# EAGLE design graphic_stereo (EAGLE 7.4.0)
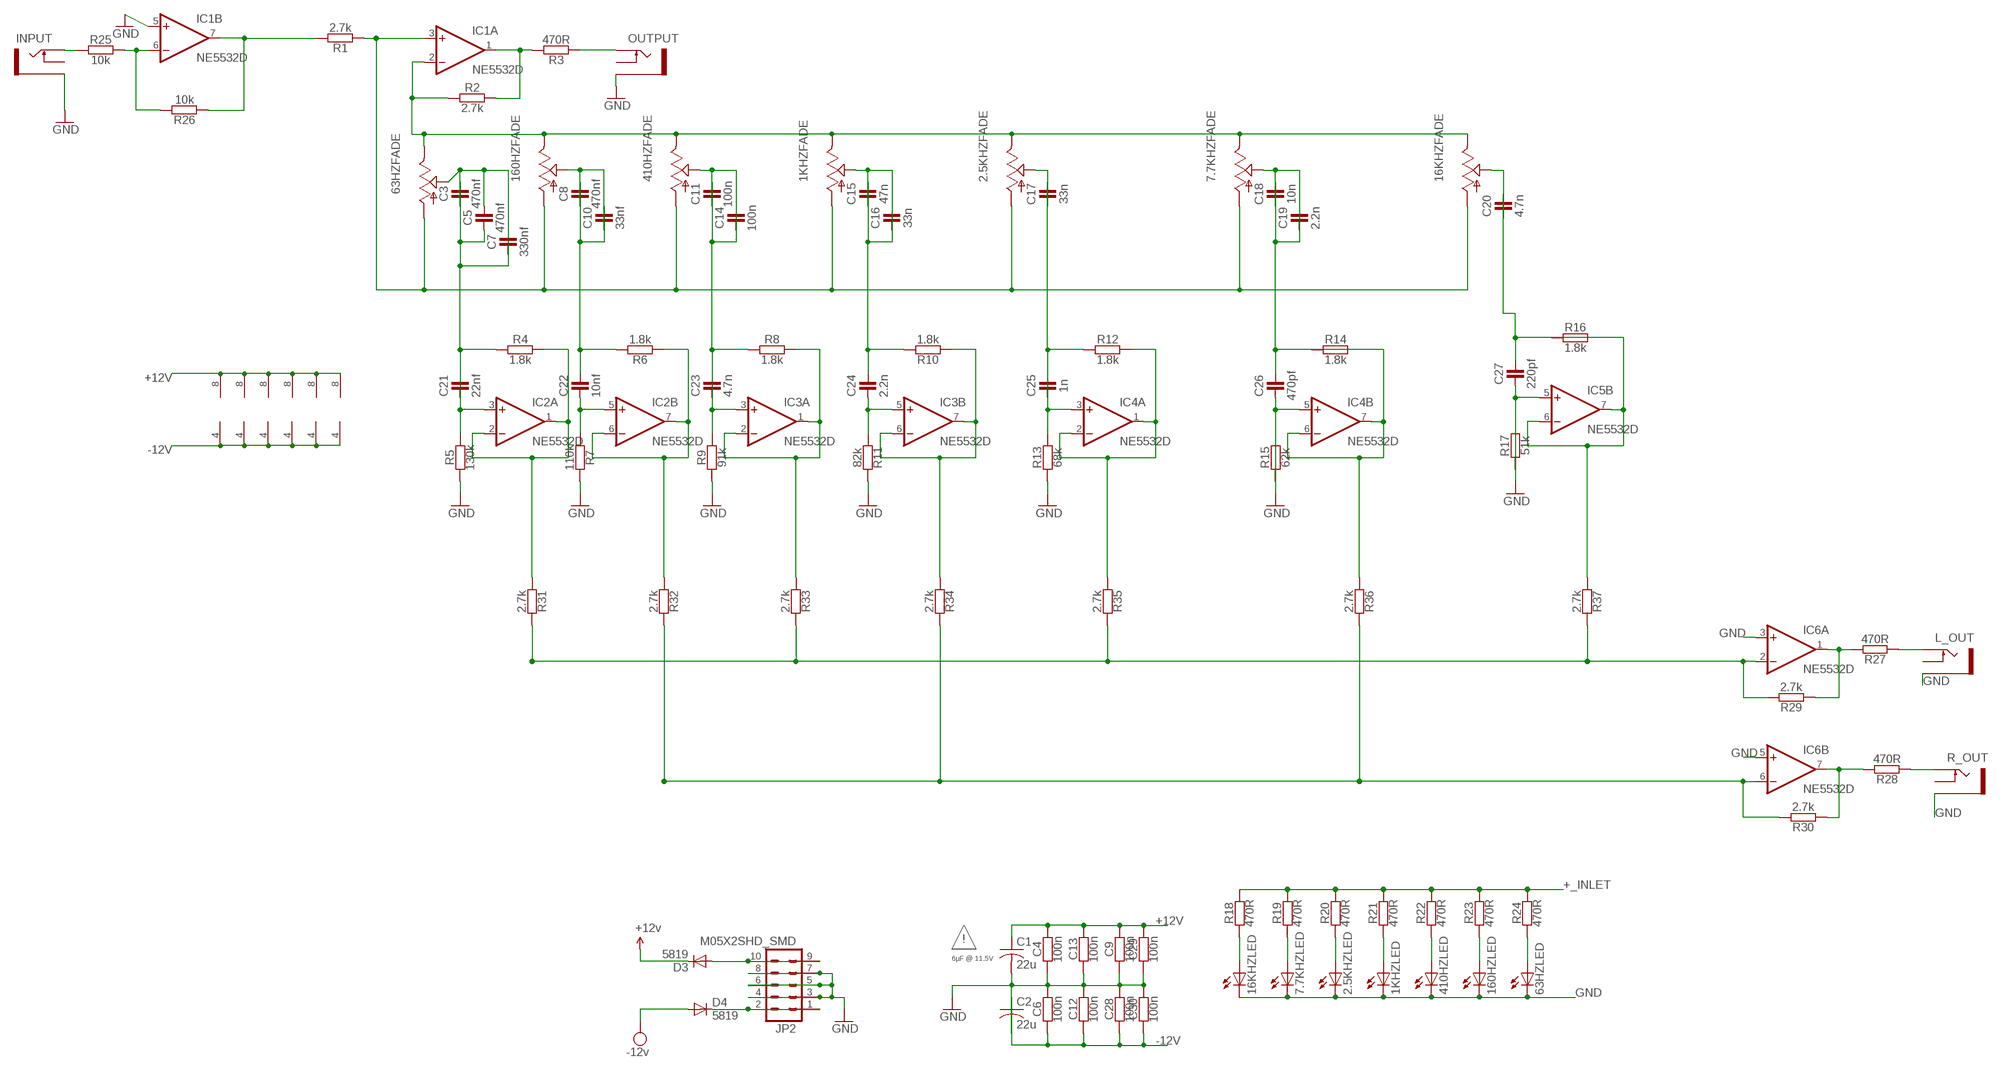
[diagram p0: schematic, sheet 1]

## Parts
1KHZ  ALPHA_20MM_ILLUM_FADER  [ALPHA_ILL_FADER_20MM]
2.5KHZ  ALPHA_20MM_ILLUM_FADER  [ALPHA_ILL_FADER_20MM]
7.7KHZ  ALPHA_20MM_ILLUM_FADER  [ALPHA_ILL_FADER_20MM]
16KHZ  ALPHA_20MM_ILLUM_FADER  [ALPHA_ILL_FADER_20MM]
63HZ  ALPHA_20MM_ILLUM_FADER  [ALPHA_ILL_FADER_20MM]
160HZ  ALPHA_20MM_ILLUM_FADER  [ALPHA_ILL_FADER_20MM]
410HZ  ALPHA_20MM_ILLUM_FADER  [ALPHA_ILL_FADER_20MM]
C1  22u  C-USC1206  [C1206]
C2  22u  C-USC1206  [C1206]
C3  470nf  CAPACITOR-0805  [C0805]
C4  100n  RESISTOR-0805  [C0805]
C5  470nf  CAPACITOR-0805  [C0805]
C6  100n  RESISTOR-0805  [C0805]
C7  330nf  CAPACITOR-0805  [C0805]
C8  470nf  CAPACITOR-0805  [C0805]
C9  100n  RESISTOR-0805  [C0805]
C10  33nf  CAPACITOR-0805  [C0805]
C11  100n  CAPACITOR-0805  [C0805]
C12  100n  RESISTOR-0805  [C0805]
C13  100n  RESISTOR-0805  [C0805]
C14  100n  CAPACITOR-0805  [C0805]
C15  47n  CAPACITOR-0805  [C0805]
C16  33n  CAPACITOR-0805  [C0805]
C17  33n  CAPACITOR-0805  [C0805]
C18  10n  CAPACITOR-0805  [C0805]
C19  2.2n  CAPACITOR-0805  [C0805]
C20  4.7n  CAPACITOR-0805  [C0805]
C21  22nf  CAPACITOR-0805  [C0805]
C22  10nf  CAPACITOR-0805  [C0805]
C23  4.7n  CAPACITOR-0805  [C0805]
C24  2.2n  CAPACITOR-0805  [C0805]
C25  1n  CAPACITOR-0805  [C0805]
C26  470pf  CAPACITOR-0805  [C0805]
C27  220pf  CAPACITOR-0805  [C0805]
C28  100n  RESISTOR-0805  [C0805]
C29  100n  RESISTOR-0805  [C0805]
C30  100n  RESISTOR-0805  [C0805]
D3  5819  DIODE-SOD123  [SOD123]
D4  5819  DIODE-SOD123  [SOD123]
IC1  NE5532D  [SO08]
IC2  NE5532D  [SO08]
IC3  NE5532D  [SO08]
IC4  NE5532D  [SO08]
IC5  NE5532D  [SO08]
IC6  NE5532D  [SO08]
INPUT  THONKICONNNEW  [WQP-PJ301M-12_JACK]
JP2  M05X2SHD_SMD  [2X5-SHROUDED_SMD]
L_OUT  THONKICONNNEW  [WQP-PJ301M-12_JACK]
OUTPUT  THONKICONNNEW  [WQP-PJ301M-12_JACK]
R1  2.7k  RESISTOR-0805  [C0805]
R2  2.7k  RESISTOR-0805  [C0805]
R3  470R  RESISTOR-0805  [C0805]
R4  1.8k  RESISTOR-0805  [C0805]
R5  130k  RESISTOR-0805  [C0805]
R6  1.8k  RESISTOR-0805  [C0805]
R7  110k  RESISTOR-0805  [C0805]
R8  1.8k  RESISTOR-0805  [C0805]
R9  91k  RESISTOR-0805  [C0805]
R10  1.8k  RESISTOR-0805  [C0805]
R11  82k  RESISTOR-0805  [C0805]
R12  1.8k  RESISTOR-0805  [C0805]
R13  68k  RESISTOR-0805  [C0805]
R14  1.8k  RESISTOR-0805  [C0805]
R15  62k  RESISTOR-0805  [C0805]
R16  1.8k  RESISTOR-0805  [C0805]
R17  51k  RESISTOR-0805  [C0805]
R18  470R  RESISTOR-0805  [C0805]
R19  470R  RESISTOR-0805  [C0805]
R20  470R  RESISTOR-0805  [C0805]
R21  470R  RESISTOR-0805  [C0805]
R22  470R  RESISTOR-0805  [C0805]
R23  470R  RESISTOR-0805  [C0805]
R24  470R  RESISTOR-0805  [C0805]
R25  10k  RESISTOR-0805  [C0805]
R26  10k  RESISTOR-0805  [C0805]
R27  470R  RESISTOR-0805  [C0805]
R28  470R  RESISTOR-0805  [C0805]
R29  2.7k  RESISTOR-0805  [C0805]
R30  2.7k  RESISTOR-0805  [C0805]
R31  2.7k  RESISTOR-0805  [C0805]
R32  2.7k  RESISTOR-0805  [C0805]
R33  2.7k  RESISTOR-0805  [C0805]
R34  2.7k  RESISTOR-0805  [C0805]
R35  2.7k  RESISTOR-0805  [C0805]
R36  2.7k  RESISTOR-0805  [C0805]
R37  2.7k  RESISTOR-0805  [C0805]
R_OUT  THONKICONNNEW  [WQP-PJ301M-12_JACK]

## Nets
+12V: C1.1 C4.2 C9.2 C13.2 C29.2 D3.C IC1.8(P:V+) IC2.8(P:V+) IC3.8(P:V+) IC4.8(P:V+) IC5.8(P:V+) IC6.8(P:V+) ; supply symbol labelled +12v
+_INLET: D3.A JP2.9 JP2.10 R18.2 R19.2 R20.2 R21.2 R22.2 R23.2 R24.2
-12V: C2.1 C6.1 C12.1 C28.1 C30.1 D4.A IC1.4(P:V-) IC2.4(P:V-) IC3.4(P:V-) IC4.4(P:V-) IC5.4(P:V-) IC6.4(P:V-) ; supply symbol labelled -12v
-_INLET: D4.C JP2.1 JP2.2
GND: 1KHZ.E(LED:C) 2.5KHZ.E(LED:C) 7.7KHZ.E(LED:C) 16KHZ.E(LED:C) 63HZ.E(LED:C) 160HZ.E(LED:C) 410HZ.E(LED:C) C1.2 C2.2 C4.1 C6.2 C9.1 C12.2 C13.1 C28.2 C29.1 C30.2 IC1.5(B:+IN) IC6.3(A:+IN) IC6.5(B:+IN) INPUT.P$3_SLEEVE(SLEEVE) JP2.3 JP2.4 JP2.5 JP2.6 JP2.7 JP2.8 L_OUT.P$3_SLEEVE(SLEEVE) OUTPUT.P$3_SLEEVE(SLEEVE) R5.1 R7.2 R9.1 R11.2 R13.1 R15.2 R17.2 R_OUT.P$3_SLEEVE(SLEEVE)
N$1: IC6.1(A:OUT) R27.2 R29.1
N$2: INPUT.P$1_TIP(TIP) R25.1
N$3: 1KHZ.3(FADE:A) 2.5KHZ.3(FADE:A) 7.7KHZ.3(FADE:A) 16KHZ.3(FADE:A) 63HZ.3(FADE:A) 160HZ.3(FADE:A) 410HZ.3(FADE:A) IC1.3(A:+IN) R1.1
N$4: 410HZ.2(FADE:S) C11.1 C14.1
N$5: IC1.1(A:OUT) R2.2 R3.2
N$6: OUTPUT.P$1_TIP(TIP) R3.1
N$7: 1KHZ.1(FADE:E) 2.5KHZ.1(FADE:E) 7.7KHZ.1(FADE:E) 16KHZ.1(FADE:E) 63HZ.1(FADE:E) 160HZ.1(FADE:E) 410HZ.1(FADE:E) IC1.2(A:-IN) R2.1
N$8: 63HZ.2(FADE:S) C3.1 C5.2 C7.1
N$9: IC1.6(B:-IN) R25.2 R26.2
N$10: 16KHZ.B(LED:A) R18.1
N$11: 2.5KHZ.2(FADE:S) C17.1
N$12: 1KHZ.2(FADE:S) C15.1 C16.1
N$13: 7.7KHZ.B(LED:A) R19.1
N$14: 160HZ.2(FADE:S) C8.1 C10.1
N$15: 2.5KHZ.B(LED:A) R20.1
N$16: C23.2 IC3.3(A:+IN) R9.2
N$17: C3.2 C5.1 C7.2 C21.1 R4.1
N$18: C8.2 C10.2 C22.2 R6.2
N$19: 7.7KHZ.2(FADE:S) C18.1 C19.1
N$20: 1KHZ.B(LED:A) R21.1
N$21: IC3.1(A:OUT) IC3.2(A:-IN) R8.2 R33.1
N$22: L_OUT.P$1_TIP(TIP) R27.1
N$23: 16KHZ.2(FADE:S) C20.1
N$24: C24.1 IC3.5(B:+IN) R11.1
N$25: C21.2 IC2.3(A:+IN) R5.2
N$26: IC2.1(A:OUT) IC2.2(A:-IN) R4.2 R31.1
N$27: IC3.6(B:-IN) IC3.7(B:OUT) R10.1 R34.1
N$28: C22.1 IC2.5(B:+IN) R7.1
N$29: IC2.6(B:-IN) IC2.7(B:OUT) R6.1 R32.1
N$30: C11.2 C14.2 C23.1 R8.1
N$31: C15.2 C16.2 C24.2 R10.2
N$32: C25.2 IC4.3(A:+IN) R13.2
N$33: IC4.1(A:OUT) IC4.2(A:-IN) R12.2 R35.1
N$34: C26.1 IC4.5(B:+IN) R15.1
N$35: IC4.6(B:-IN) IC4.7(B:OUT) R14.1 R36.1
N$36: C17.2 C25.1 R12.1
N$37: C18.2 C19.2 C26.2 R14.2
N$38: C27.1 IC5.5(B:+IN) R17.1
N$39: IC5.6(B:-IN) IC5.7(B:OUT) R16.1 R37.1
N$40: C20.2 C27.2 R16.2
N$41: 410HZ.B(LED:A) R22.1
N$42: 160HZ.B(LED:A) R23.1
N$43: 63HZ.B(LED:A) R24.1
N$44: R28.1 R_OUT.P$1_TIP(TIP)
N$45: IC1.7(B:OUT) R1.2 R26.1
N$46: IC6.7(B:OUT) R28.2 R30.1
N$47: IC6.6(B:-IN) R30.2 R32.2 R34.2 R36.2
N$49: IC6.2(A:-IN) R29.2 R31.2 R33.2 R35.2 R37.2
Unconnected: IC5.1(A:OUT) IC5.2(A:-IN) IC5.3(A:+IN) INPUT.P$2_SWITCH(SWITCH) L_OUT.P$2_SWITCH(SWITCH) OUTPUT.P$2_SWITCH(SWITCH) R_OUT.P$2_SWITCH(SWITCH)

## Notes on the sheet
- !
- 6µF @ 11.5V

## Library data of the parts
1KHZ 2.5KHZ 7.7KHZ 16KHZ 63HZ 160HZ 410HZ = TomW:ALPHA_20MM_ILLUM_FADER: 30mm Alpha Illuminated Fader
C1 C2 = rcl:C-US: CAPACITOR, American symbol
C3 C5 C7 C8 C10 C11 C14-C27 = we-rcl:CAPACITOR: Capacitors ...2.2uF @ 6.3V -> 0402 ...4.7uF @ 6.3V -> 0603 ...10uF @ 16V -> 0805 ...22uF @ 25V -> 1206
C4 C6 C9 C12 C13 C28-C30 R1-R37 = we-rcl:RESISTOR: Resistors all kinds in 0402 and 0603
D3 D4 = diode:DIODE-: DIODE
IC1-IC6 = linear:NE5532: AUDIO AMPLIFIER
INPUT L_OUT OUTPUT R_OUT = MusicThingModular:THONKICONN: 3.5mm socket for Eurorack modular synths
JP2 = SparkFun-Connectors:M05X2: Header 5x2 Standard 10-pin dual row 0.1" header. Commonly used with AVR-ISP. Use with Spark Fun Electronics SKU: PRT-00778

## Net classes
0 default: width 0.203 mm
1 power: width 0.406 mm

## Board
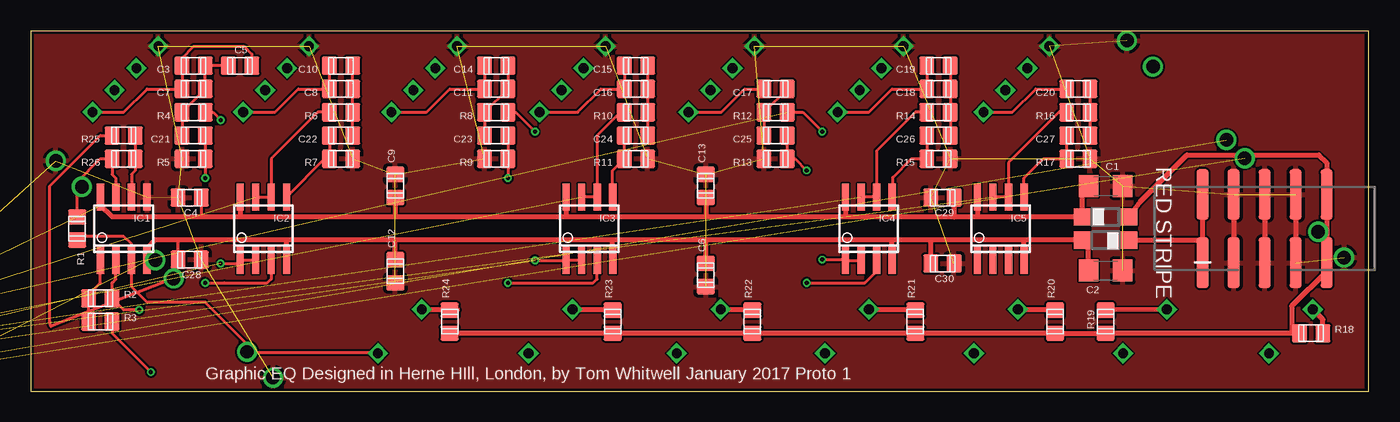
[diagram p1: board, top side]
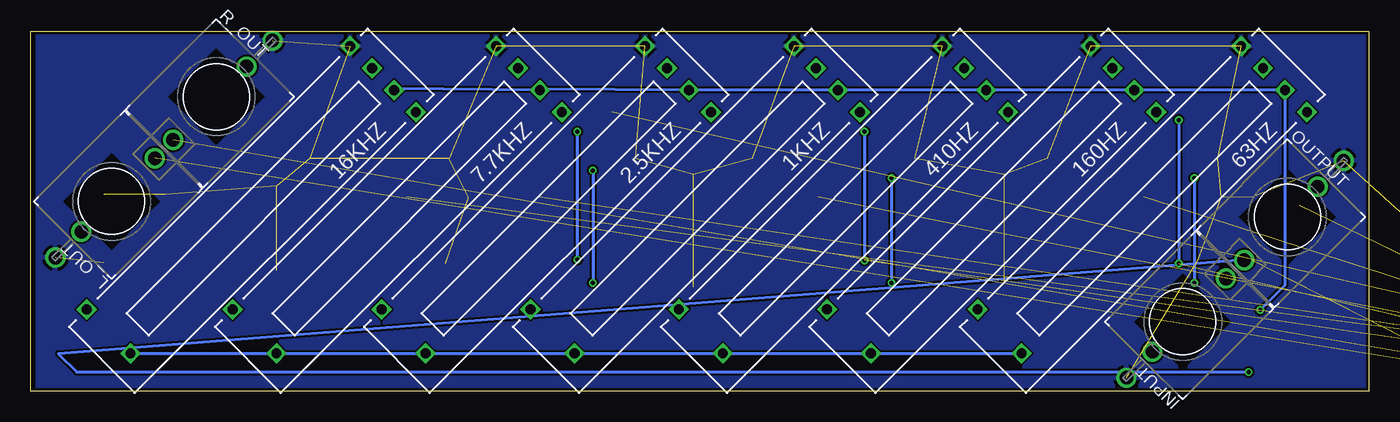
[diagram p2: board, bottom side, seen from below]

Size 109.5 x 29.5 mm. Coordinates in mm from the lower left corner, seen from the top.
Outline: 0,0 109.5,0 109.5,29.5 0,29.5 0,0
Copper layers (1*2*15*16): Top 0.035mm / dielectric 0.2mm / Route2 0.0175mm / dielectric 1.1mm / Route15 0.0175mm / dielectric 0.2mm / Bottom 0.035mm
Design rules "SeeedStudio_DRU_no_angle_20130527": minimum track width 6mil, minimum drill 12mil, track to track 6mil, track to pad 6mil, pad to pad 6mil, via to via 6mil, smd to smd 0mil, copper to edge 10mil, drill to drill 10mil, minimum pad ring 6mil, minimum via ring 6mil, stop-mask expansion 2mil, vias tented up to drill 25mil, thermal gap 10mil

### Footprints (pad centres in the part's own frame; a part is rotated, then mirrored left to right if it is on the bottom)
ALPHA_ILL_FADER_20MM = drill 0.8 square: 1 -15.24,1.27; 2 -15.24,3.81; 3 15.24,1.27; B 15.24,-3.81; E -15.24,-3.81; L -15.24,-1.27
C1206 = smd 1.6 x 1.8: 1 -1.4,0; 2 1.4,0
C0805 = smd 1.5 x 1.25: 1 0,0.95; 2 0,-0.95
SOD123 = smd 1.4 x 1.4: A 1.9,0; C -1.9,0
SO08 = smd 0.6 x 2.2: 1 -1.905,-2.6; 2 -0.635,-2.6; 3 0.635,-2.6; 4 1.905,-2.6; 5 1.905,2.6; 6 0.635,2.6; 7 -0.635,2.6; 8 -1.905,2.6
WQP-PJ301M-12_JACK = drill 1.1: P$1_TIP 0,5; P$2_SWITCH 0,-3.5; P$3_SLEEVE 0,-6.5
2X5-SHROUDED_SMD = smd 4.15 x 1: 1 -2.794,5.08; 2 2.794,5.08; 3 -2.794,2.54; 4 2.794,2.54; 5 -2.794,0; 6 2.794,0; 7 -2.794,-2.54; 8 2.794,-2.54; 9 -2.794,-5.08; 10 2.794,-5.08

### Placement (x,y rotation side)
1KHZ  55.12,14.8 225 bottom
2.5KHZ  67.31,14.8 225 bottom
7.7KHZ  79.5,14.8 225 bottom
16KHZ  91.44,14.8 225 bottom
63HZ  18.54,14.8 225 bottom
160HZ  30.86,14.8 225 bottom
410HZ  42.99,14.8 225 bottom
C1  87.95,16.83 0 top
C2  87.95,9.91 0 top
C3  13.34,26.67 90 top
C4  13.02,15.88 90 top
C5  17.14,26.67 90 top
C6  55.24,9.53 0 top
C7  13.34,24.77 90 top
C8  25.4,24.77 90 top
C9  29.84,16.83 0 top
C10  25.4,26.67 90 top
C11  38.1,24.77 90 top
C12  29.84,9.84 0 top
C13  55.24,16.83 0 top
C14  38.1,26.67 90 top
C15  49.53,26.67 90 top
C16  49.53,24.77 90 top
C17  60.96,24.77 90 top
C18  74.3,24.77 90 top
C19  74.3,26.67 90 top
C20  85.72,24.77 90 top
C21  13.34,20.95 90 top
C22  25.4,20.95 90 top
C23  38.1,20.95 90 top
C24  49.53,20.95 90 top
C25  60.96,20.95 90 top
C26  74.3,20.95 90 top
C27  85.72,20.95 90 top
C28  13.02,10.79 90 top
C29  74.61,15.88 90 top
C30  74.61,10.48 90 top
D3  87.95,14.29 0 top
D4  87.95,12.38 180 top
IC1  7.62,13.34 0 top
IC2  19.05,13.34 0 top
IC3  45.72,13.34 0 top
IC4  68.58,13.34 0 top
IC5  79.38,13.34 0 top
IC6  -17.14,0.64 0 top  (outside the outline)
INPUT  15.24,5.71 315 bottom
JP2  100.97,13.34 90 top
L_OUT  102.87,15.56 315 bottom
OUTPUT  6.67,14.29 135 bottom
R1  3.81,13.34 180 top
R2  5.71,7.62 270 top
R3  5.71,5.71 270 top
R4  13.34,22.86 90 top
R5  13.34,19.05 90 top
R6  25.4,22.86 90 top
R7  25.4,19.05 90 top
R8  38.1,22.86 90 top
R9  38.1,19.05 90 top
R10  49.53,22.86 90 top
R11  49.53,19.05 90 top
R12  60.96,22.86 90 top
R13  60.96,19.05 90 top
R14  74.3,22.86 90 top
R15  74.3,19.05 90 top
R16  85.72,22.86 90 top
R17  85.72,19.05 90 top
R18  104.78,4.76 270 top
R19  87.95,5.71 0 top
R20  83.82,5.71 0 top
R21  72.39,5.71 0 top
R22  59.05,5.71 0 top
R23  47.62,5.71 0 top
R24  34.29,5.71 0 top
R25  7.62,20.95 90 top
R26  7.62,19.05 90 top
R27  -20.95,-1.27 0 top  (outside the outline)
R28  -23.18,-1.27 0 top  (outside the outline)
R29  -25.4,-1.27 0 top  (outside the outline)
R30  -27.62,-1.27 0 top  (outside the outline)
R31  -29.84,-1.27 0 top  (outside the outline)
R32  -32.07,-1.27 0 top  (outside the outline)
R33  -34.29,-1.27 0 top  (outside the outline)
R34  -36.51,-1.27 0 top  (outside the outline)
R35  -38.73,-1.27 0 top  (outside the outline)
R36  -40.96,-1.27 0 top  (outside the outline)
R37  -43.18,-1.27 0 top  (outside the outline)
R_OUT  94.3,24.13 135 bottom

### Tracks (layer width: path | path; a pad name or v marks a point on that pad's centre or on a via)
+12V  (1 unrouted)
  Top 0.254: 86.05,17.01 C1.1 | C4.2 13.97,14.29
  Top 0.406: 77.47,14.29 D3.C 86.05,17.01 | 77.47,14.29 75.56,14.29 | 75.56,14.29 66.67,14.29 | 66.67,14.29 55.24,14.29 | 55.24,14.29 43.81,14.29 | 43.81,14.29 29.84,14.29 | 29.84,14.29 17.14,14.29 | 17.14,14.29 13.97,14.29 6.67,14.29 5.71,15.24 IC1.8 | IC5.8 77.47,14.29 | IC4.8 66.67,14.29 | IC3.8 43.81,14.29 | IC2.8 17.14,14.29 | C13.2 55.24,14.29 | C9.2 29.84,14.29 | C29.2 75.56,14.29
+_INLET
  Top 0.406: D3.A 90.8,15.55 94.61,19.37 105.41,19.37 106.05,18.73 JP2.10 JP2.9 106.05,9.84 103.19,6.99 103.19,4.76 | R18.2 103.19,4.76 | 103.19,4.76 R19.2 R20.2 R21.2 R22.2 | R22.2 58.42,4.76 R22.2 | R22.2 R23.2 R24.2
-12V  (1 unrouted)
  Top 0.254: C28.1 12.07,12.38 12.06,12.38 | 86.55,11.93 D4.A
  Top 0.406: D4.A 81.28,12.38 | 81.28,12.38 73.66,12.38 | 73.66,12.38 70.48,12.38 | 70.48,12.38 55.24,12.38 | 55.24,12.38 47.62,12.38 | 47.62,12.38 29.84,12.38 | 29.84,12.38 20.95,12.38 | 20.95,12.38 12.06,12.38 10.16,12.38 9.53,11.75 IC1.4 | IC2.4 20.95,12.38 | IC3.4 47.62,12.38 | IC4.4 70.48,12.38 | IC5.4 81.28,12.38 | C6.1 55.24,12.38 | C12.1 29.84,12.38 | C30.1 73.66,12.38 | C2.1 86.55,11.93
-_INLET
  Top 0.406: JP2.2 95.89,12.38 | 95.89,12.38 JP2.1 | D4.C 95.89,12.38
GND  (33 unrouted)
  Top 0.406: JP2.8 JP2.7 | JP2.6 JP2.5 | JP2.4 JP2.3
  pour Top: 0,29.53 108.9,29.53 108.9,0 0,0
  pour Bottom: 0,29.53 108.9,29.53 108.9,0 0,0 0,29.21
N$1  (2 unrouted)
N$2
  Top 0.254: INPUT.P$1_TIP 1.67,5.32 1.59,5.71 1.59,16.83 5.71,20.95 R25.1
N$3
  Top 0.254: 63HZ.3 28.31,3.12 28.26,3.17 18.41,3.17 14.29,7.3 9.53,7.3 8.26,8.57 IC1.3 8.26,12.06 7.62,12.7 4.12,12.7 R1.1
  Bottom 0.254: 16KHZ.3 7.7KHZ.3 2.5KHZ.3 | 2.5KHZ.3 76.57,3.12 76.52,3.17 77.13,3.17 2.5KHZ.3 | 2.5KHZ.3 1KHZ.3 410HZ.3 160HZ.3 63HZ.3
N$4
  Top 0.254: 410HZ.2 32.4,22.88 34.29,24.77 C11.1 C14.1
N$5
  Top 0.254: R3.2 R2.2 4.76,7.94 5.71,8.89 IC1.1
N$6  (via drill 0.33)
  Top 0.254: R3.1 6.67,4.76 v9.84,1.59
  Bottom 0.254: OUTPUT.P$1_TIP 107.23,3.1 105.73,1.59 v9.84,1.59
N$7  (via drill 0.33)
  Top 0.254: IC1.2 6.99,9.21 6.67,8.89 R2.1 7.62,6.67 v8.89,6.67
  Bottom 0.254: 16KHZ.1 79.64,24.8 7.7KHZ.1 67.76,24.74 2.5KHZ.1 1KHZ.1 410HZ.1 160HZ.1 63HZ.1 6.87,8.69 v8.89,6.67
N$8
  Top 0.254: C5.2 18.1,27.62 17.46,28.26 13.34,28.26 12.38,27.31 C3.1 C7.1 9.53,24.77 7.64,22.88 63HZ.2
N$9
  Top 0.254: R25.2 R26.2 8.57,18.09 8.26,17.78 IC1.6
N$10
  Top 0.406: R18.1 105.72,5.9 16KHZ.B
N$11
  Top 0.254: 2.5KHZ.2 56.52,22.86 58.42,24.77 C17.1
N$12
  Top 0.254: 1KHZ.2 44.77,22.86 46.67,24.77 C16.1 C15.1
N$13
  Top 0.406: 7.7KHZ.B R19.1
N$14
  Top 0.254: C10.1 C8.1 21.91,24.77 20.02,22.88 160HZ.2
N$15
  Top 0.406: 2.5KHZ.B 83.77,6.71 R20.1
N$16  (via drill 0.33)
  Top 0.254: C23.2 R9.2 v39.05,17.46 | v39.05,8.89 46.04,8.89 46.35,9.21 IC3.3
  Bottom 0.254: v39.05,17.46 v39.05,8.89
N$17
  Top 0.254: C5.1 C3.2 C7.2 R4.1 C21.1
N$18
  Top 0.254: C22.2 R6.2 C8.2 C10.2
N$19
  Top 0.254: 7.7KHZ.2 68.58,22.86 70.48,24.77 C18.1 C19.1
N$20
  Top 0.406: 1KHZ.B 72.34,6.71 R21.1
N$21  (via drill 0.33)  (1 unrouted)
  Top 0.254: R8.2 39.69,22.86 v41.27,21.27 | v41.27,10.73 IC3.1 IC3.2
  Bottom 0.254: v41.27,21.27 v41.27,10.73
N$22  (1 unrouted)
N$23
  Top 0.254: 16KHZ.2 80.34,22.88 82.23,24.77 C20.1
N$24
  Top 0.254: IC3.5 47.62,18.09 R11.1 C24.1
N$25  (via drill 0.33)
  Top 0.254: IC2.3 19.68,9.21 19.37,8.89 15.88,8.89 v14.29,8.89 | C21.2 R5.2 v14.29,17.46
  Bottom 0.254: v14.29,17.46 v14.29,8.89
N$26  (via drill 0.33)  (1 unrouted)
  Top 0.254: R4.2 14.92,22.86 v15.56,22.23 | v15.56,10.48 16.89,10.48 IC2.1 IC2.2
  Bottom 0.254: v15.56,22.23 v15.56,10.48
N$27  (1 unrouted)
  Top 0.254: R10.1 48.26,22.86 46.35,20.95 IC3.6 IC3.7
N$28
  Top 0.254: C22.1 R7.1 24.07,19.05 IC2.5
N$29  (1 unrouted)
  Top 0.254: IC2.7 IC2.6 19.68,19.05 23.5,22.86 R6.1
N$30
  Top 0.254: C14.2 C11.2 R8.1 C23.1
N$31
  Top 0.254: C15.2 C16.2 R10.2 C24.2
N$32  (via drill 0.33)
  Top 0.254: C25.2 R13.2 62.55,19.05 v63.5,18.1 | v63.5,8.89 68.26,8.89 69.22,9.84 IC4.3
  Bottom 0.254: v63.5,18.1 v63.5,8.89
N$33  (via drill 0.33)  (1 unrouted)
  Top 0.254: R12.2 63.18,22.86 v64.77,21.27 | v64.77,10.79 66.61,10.79 IC4.1 IC4.2
  Bottom 0.254: v64.77,21.27 v64.77,10.79
N$34
  Top 0.254: C26.1 R15.1 72.07,19.05 70.55,17.52 70.55,15.88 IC4.5
N$35  (1 unrouted)
  Top 0.254: R14.1 72.39,22.86 69.22,19.68 IC4.6 IC4.7
N$36
  Top 0.254: C17.2 R12.1 C25.1
N$37
  Top 0.254: C18.2 C19.2 R14.2 C26.2
N$38
  Top 0.254: IC5.5 81.28,17.46 82.87,19.05 R17.1 C27.1
N$39  (1 unrouted)
  Top 0.254: R16.1 84.14,22.86 80.01,18.73 IC5.6 IC5.7
N$40
  Top 0.254: C20.2 R16.2 C27.2
N$41
  Top 0.406: 410HZ.B 59.01,6.71 R22.1
N$42
  Top 0.406: 160HZ.B 47.58,6.71 R23.1
N$43
  Top 0.406: 63HZ.B 34.88,6.71 34.92,6.67 R24.1
N$44  (1 unrouted)
N$45
  Top 0.254: IC1.7 6.99,17.46 6.67,17.78 R26.1 5.71,19.05 3.81,17.14 R1.2
N$46  (2 unrouted)
N$47  (4 unrouted)
N$49  (5 unrouted)

### Text on the board
tPlace: Graphic EQ Designed in Herne HIll, London, by Tom Whitwell January 2017 Proto 1
tDocu: n$3 = CUT / n$7 = boost / / 75ml placement grid / 12.5mil routing grid